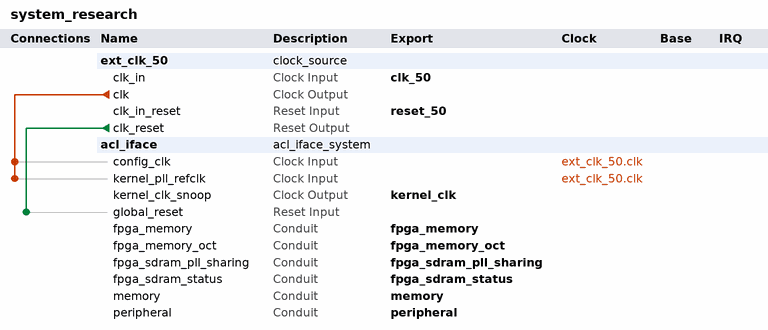
[diagram p0: system contents]
# Platform Designer (Qsys) system system_research, Cyclone V 5CSXFC6D6F31C8ES
# Parameters at their usual value, and those the tool derives, are not listed.
package require -exact qsys 13.1
create_system system_research
set_project_property DEVICE_FAMILY {Cyclone V}
set_project_property DEVICE 5CSXFC6D6F31C8ES

add_instance ext_clk_50 clock_source 13.1
set_instance_parameter_value ext_clk_50 clockFrequency 50000000

add_instance acl_iface acl_iface_system 1.0

# connections
add_connection ext_clk_50.clk acl_iface.config_clk clock
add_connection ext_clk_50.clk acl_iface.kernel_pll_refclk clock
add_connection ext_clk_50.clk_reset acl_iface.global_reset reset

# exported interfaces
add_interface clk_50 clock sink
set_interface_property clk_50 EXPORT_OF ext_clk_50.clk_in
add_interface reset_50 reset sink
set_interface_property reset_50 EXPORT_OF ext_clk_50.clk_in_reset
add_interface kernel_clk clock source
set_interface_property kernel_clk EXPORT_OF acl_iface.kernel_clk_snoop
add_interface fpga_memory conduit end
set_interface_property fpga_memory EXPORT_OF acl_iface.fpga_memory
add_interface fpga_memory_oct conduit end
set_interface_property fpga_memory_oct EXPORT_OF acl_iface.fpga_memory_oct
add_interface fpga_sdram_status conduit end
set_interface_property fpga_sdram_status EXPORT_OF acl_iface.fpga_sdram_status
add_interface fpga_sdram_pll_sharing conduit end
set_interface_property fpga_sdram_pll_sharing EXPORT_OF acl_iface.fpga_sdram_pll_sharing
add_interface memory conduit end
set_interface_property memory EXPORT_OF acl_iface.memory
add_interface peripheral conduit end
set_interface_property peripheral EXPORT_OF acl_iface.peripheral

set_interconnect_requirement {$system} qsys_mm.clockCrossingAdapter FIFO
set_interconnect_requirement {$system} qsys_mm.maxAdditionalLatency 0

save_system system_research.qsys
